# EAGLE design TPS54340 PS and Load Rev3 (EAGLE 9.3.0)
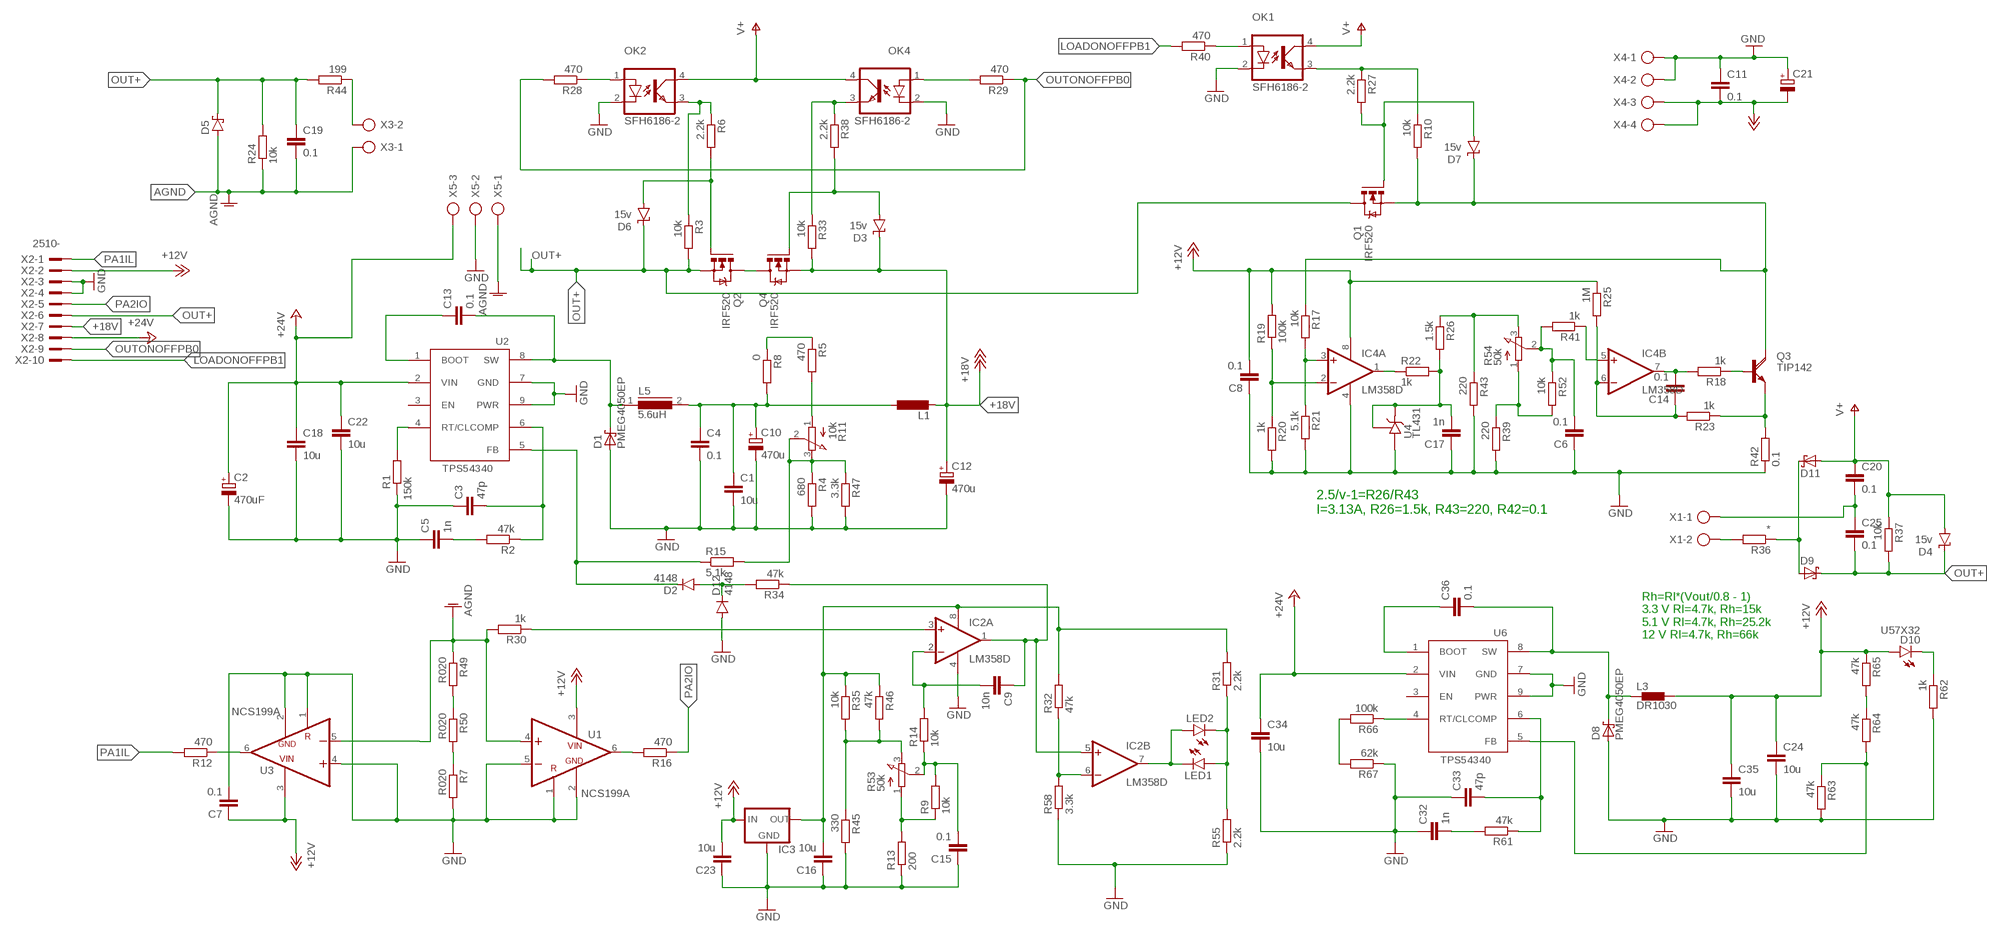
[diagram p0: schematic, sheet 1]

## Parts
C1  10u  C-EUC1210  [C1210]
C2  470uF  CPOL-EUE5-10.5  [E5-10,5]
C3  47p  C-EUC0603K  [C0603K]
C4  0.1  C-EUC1206  [C1206]
C5  1n  C-EUC0603K  [C0603K]
C6  0.1  C-EUC0603K  [C0603K]
C7  0.1  C-EUC0603K  [C0603K]
C8  0.1  C-EUC0603K  [C0603K]
C9  10n  C-EUC0603K  [C0603K]
C10  470u  CPOL-EUE5-10.5  [E5-10,5]
C11  0.1  C-EUC1206  [C1206]
C12  470u  CPOL-EUE5-10.5  [E5-10,5]
C13  0.1  C-EU102-043X133  [C102-043X133]
C14  0.1  C-EUC0603K  [C0603K]
C15  0.1  C-EUC0603K  [C0603K]
C16  10u  C-EUC0603K  [C0603K]
C17  1n  C-EUC0603K  [C0603K]
C18  10u  C-EUC1210  [C1210]
C19  0.1  C-EUC1206  [C1206]
C20  0.1  C-EUC1206  [C1206]
C21  CPOL-EUE2.5-6  [E2,5-6]
C22  10u  C-EUC1210  [C1210]
C23  10u  C-EUC0603K  [C0603K]
C24  10u  C-EUC1210  [C1210]
C25  0.1  C-EUC1206  [C1206]
C32  1n  C-EUC0603K  [C0603K]
C33  47p  C-EUC0603K  [C0603K]
C34  10u  C-EUC1210  [C1210]
C35  10u  C-EUC1206  [C1206]
C36  0.1  C-EU102-043X133  [C102-043X133]
D1  PMEG4050EP  [SOD128]
D2  4148  PMLL41SOD80C  [SOD80C]
D3  15v  SUPPRESSOR-SMBJ  [SMBJ]
D4  15v  SUPPRESSOR-SMBJ  [SMBJ]
D5  SCHOTTKY-DIODESMD  [SMB]
D6  15v  SUPPRESSOR-SMBJ  [SMBJ]
D7  15v  SUPPRESSOR-SMBJ  [SMBJ]
D8  PMEG4050EP  [SOD128]
D9  PMEG4050EP  [SOD128]
D10  U57X32  [U57X32]
D11  PMEG4050EP  [SOD128]
D12  4148  PMLL41SOD80C  [SOD80C]
IC2  LM358D  [SO08]
IC3  LM1117  [SOT223]
IC4  LM358D  [SO08]
L1  L-EU0207/5V  [0207/5V]
L3  DR1030  [DR1030]
L5  5.6uH  DR125  [DR125]
LED1  LEDB152  [Q62902-B152]
LED2  LEDB152  [Q62902-B152]
OK1  SFH6186-2  [SMD4-7]
OK2  SFH6186-2  [SMD4-7]
OK4  SFH6186-2  [SMD4-7]
Q1  IRF520  [TO220BV]
Q2  IRF520  [TO220BV]
Q3  TIP142  [SOT93]
Q4  IRF520  [TO220BV]
R1  150k  R-EU_R1206  [R1206]
R2  47k  R-EU_R0603  [R0603]
R3  10k  R-EU_R0603  [R0603]
R4  680  R-EU_R1206  [R1206]
R5  470  R-EU_R1206  [R1206]
R6  2.2k  R-EU_R0603  [R0603]
R7  R020  R-EU_R1206  [R1206]
R8  0  R-EU_R0603  [R0603]
R9  10k  R-EU_R0603  [R0603]
R10  10k  R-EU_R0603  [R0603]
R11  10k  3RP/1610N  [3RP/1610N]
R12  470  R-EU_R0603  [R0603]
R13  200  R-EU_R0603  [R0603]
R14  10k  R-EU_R1206  [R1206]
R15  5.1k  R-EU_R0603  [R0603]
R16  470  R-EU_R1206  [R1206]
R17  10k  R-EU_R0603  [R0603]
R18  1k  R-EU_R0603  [R0603]
R19  100k  R-EU_R1206  [R1206]
R20  1k  R-EU_R0603  [R0603]
R21  5.1k  R-EU_R0603  [R0603]
R22  1k  R-EU_R0603  [R0603]
R23  1k  R-EU_R0603  [R0603]
R24  10k  R-EU_R1206  [R1206]
R25  1M  R-EU_R1206  [R1206]
R26  1.5k  R-EU_R0603  [R0603]
R27  2.2k  R-EU_R0603  [R0603]
R28  470  R-EU_R0603  [R0603]
R29  470  R-EU_R0603  [R0603]
R30  1k  R-EU_R0603  [R0603]
R31  2.2k  R-EU_R0603  [R0603]
R32  47k  R-EU_R0603  [R0603]
R33  10k  R-EU_R0603  [R0603]
R34  47k  R-EU_R0603  [R0603]
R35  10k  R-EU_R0603  [R0603]
R36  *  R-EU_R1206  [R1206]
R37  10k  R-EU_R1206  [R1206]
R38  2.2k  R-EU_R0603  [R0603]
R39  220  R-EU_R0603  [R0603]
R40  470  R-EU_R0603  [R0603]
R41  1k  R-EU_R1206  [R1206]
R42  0.1  R-EU_0414/15  [0414/15]
R43  220  R-EU_R0603  [R0603]
R44  199  R-EU_R0603  [R0603]
R45  330  R-EU_R0603  [R0603]
R46  47k  R-EU_R0603  [R0603]
R47  3.3k  R-EU_R1206  [R1206]
R49  R020  R-EU_R1206  [R1206]
R50  R020  R-EU_R1206  [R1206]
R52  10k  R-EU_R0603  [R0603]
R53  50k  3RP/1610N  [3RP/1610N]
R54  50k  3RP/1610N  [3RP/1610N]
R55  2.2k  R-EU_R0603  [R0603]
R58  3.3k  R-EU_R0603  [R0603]
R61  47k  R-EU_R0603  [R0603]
R62  1k  R-EU_R0603  [R0603]
R63  47k  R-EU_R0603  [R0603]
R64  47k  R-EU_R0603  [R0603]
R65  47k  R-EU_R0603  [R0603]
R66  100k  R-EU_R0603  [R0603]
R67  62k  R-EU_R0603  [R0603]
U1  NCS199A  [SOT363]
U2  TPS54340  TPS54340SO8  [HSOP]
U3  NCS199A  [SOT363]
U4  TL431  [SOT23]
U6  TPS54340SO8  [HSOP]
X1  AK500/2  [AK500/2]
X2  2510-  [PAK100/2500-10]
X3  AK500/2  [AK500/2]
X4  AK500/4  [AK500/4]
X5  AK500/3  [AK500/3]

## Nets
+12V: C7.1 C8.2 C11.2 C21.- C23.2 C24.1 C35.1 D10.A IC3.3(IN) IC4.8(P:V+) L3.2 R19.2 R25.1 R65.1 U1.3(VCC) U3.3(VCC) X2.2 X4.3 X4.4
+18V: C12.+ D3.C L1.2 Q4.S R33.2 X2.7
+24V: C2.+ C18.1 C22.1 C34.1 U2.2(VIN) U6.2(VIN) X2.8 X5.3
AGND: C19.2 D5.A R24.1 R30.2 R49.1 U1.4(IN+) U3.5(IN-) X3.1 X5.1
GND: C1.2 C2.- C3.1 C4.2 C5.1 C6.1 C7.2 C8.1 C10.- C11.1 C12.- C15.1 C16.1 C17.1 C18.2 C21.+ C22.2 C23.1 C24.2 C32.1 C33.1 C34.2 C35.2 D1.2(A) D8.2(A) D12.A IC2.4(P:V-) IC3.1(GND) IC4.4(P:V-) OK1.2(C) OK2.2(C) OK4.2(C) R1.1 R4.2 R7.2 R13.1 R20.2 R21.2 R39.2 R42.1 R43.2 R45.2 R47.2 R55.1 R58.1 R62.2 R63.2 R67.1 U1.1(REF) U1.2(GND) U1.5(IN-) U2.7(GND) U2.9(PWR) U3.1(REF) U3.2(GND) U3.4(IN+) U4.3(A) U6.7(GND) U6.9(PWR) X2.3 X2.4 X4.1 X4.2 X5.2
LOADONOFFPB1: R40.2 X2.10
N$1: R1.2 U2.4(RT/CL)
N$2: C5.2 R2.2
N$3: C3.2 R2.1 U2.6(COMP)
N$4: R5.2 R11.1(A)
N$5: D6.A Q2.G R6.2
N$6: IC2.3(A:+IN) R30.1
N$7: R4.1 R11.2(S) R11.3(E) R15.2 R47.1
N$8: C16.2 IC2.8(P:V+) IC3.2(OUT) IC3.4(OUT) R31.2 R32.2 R35.1 R46.1
N$9: R16.2 U1.6(OUT)
N$10: OK2.3(EMIT) R3.1 R6.1
N$11: R36.2 X1.2
N$12: D3.A Q4.G R38.2
N$13: C13.1 U2.1(BOOT)
N$14: C13.2 D1.1(K) L5.1 U2.8(SW)
N$15: R12.1 U3.6(OUT)
N$16: C9.2 IC2.2(A:-IN) R14.2
N$17: D9.2(A) D11.1(K) R36.1
N$18: R44.1 X3.2
N$19: C15.2 R9.2 R14.1 R53.2(S)
N$20: D2.A D12.C R34.2
N$21: D2.C R15.1 U2.5(FB)
N$22: C20.2 C25.1 X1.1
N$23: Q2.D Q4.D
N$24: IC2.7(B:OUT) LED1.K(C) LED2.A
N$25: C1.1 C4.1 C10.+ L1.1 L5.2 R8.2
N$26: Q3.B R18.1
N$27: OK1.1(A) R40.1
N$28: C14.1 IC4.6(B:-IN) R23.2 R25.2
N$30: R26.1 R43.1 R54.3(E)
N$31: D7.C Q1.S Q3.C R10.2 R17.1
N$32: OK1.3(EMIT) R10.1 R27.1
N$34: LED1.A LED2.K(C) R31.1 R55.2
N$35: R35.2 R45.1 R46.2 R53.3(E)
N$36: IC4.5(B:+IN) R41.1
N$37: IC2.6(B:-IN) R32.1 R58.2
N$41: D7.A Q1.G R27.2
N$42: R39.1 R52.2 R54.1(A)
N$45: R9.1 R13.2 R53.1(A)
N$46: R49.2 R50.1
N$47: R63.1 R64.2 U6.5(FB)
N$48: C9.1 IC2.1(A:OUT) IC2.5(B:+IN) R34.1
N$49: R66.1 U6.4(RT/CL)
N$50: C33.2 R61.1 U6.6(COMP)
N$51: C36.1 U6.1(BOOT)
N$52: R7.1 R50.2
N$53: C36.2 D8.1(K) L3.1 U6.8(SW)
N$54: C32.2 R61.2
N$55: R64.1 R65.2
N$56: D10.K(C) R62.1
N$57: R66.2 R67.2
N$61: OK4.3(EMIT) R33.1 R38.1
N$62: OK4.1(A) R29.2
N$64: OK2.1(A) R28.1
N$65: C17.2 R22.2 R26.2 U4.1(C) U4.2(R)
N$66: R5.1 R8.1
N$106: Q3.E R23.1 R42.2
N$289: C14.2 IC4.7(B:OUT) R18.2
N$290: C6.2 R41.2 R52.1 R54.2(S)
N$291: IC4.1(A:OUT) R22.1
N$292: IC4.3(A:+IN) R17.2 R21.1
N$294: IC4.2(A:-IN) R19.1 R20.1
OUT+: C19.1 C25.2 D4.C D5.C D6.C D9.1(K) Q1.D Q2.S R3.2 R24.2 R37.2 R44.2 X2.6
OUTONOFFPB0: R28.2 R29.1 X2.9
PA1IL: R12.2 X2.1
PA2IO: R16.1 X2.5
V+: C20.1 D4.A D11.2(A) OK1.4(COL) OK2.4(COL) OK4.4(COL) R37.1
Unconnected: U2.3(EN) U6.3(EN)

## Notes on the sheet
- 2.5/v-1=R26/R43
  I=3.13A, R26=1.5k, R43=220, R42=0.1
- Rh=Rl*(Vout/0.8 - 1)
  3.3 V Rl=4.7k, Rh=15k
  5.1 V Rl=4.7k, Rh=25.2k
  12 V Rl=4.7k, Rh=66k

## Library data of the parts
C1 C3 C5-C9 C13-C18 C22-C24 C32-C34 C36 = rcl:C-EU: CAPACITOR, European symbol; SPICEPREFIX: C
C2 C10 C12 C21 = rcl:CPOL-EU: POLARIZED CAPACITOR, European symbol; SPICEPREFIX: C
C4 C11 C19 C20 C25 C35 = rcl:C-EU: CAPACITOR, European symbol
D1 D8 D9 D11 = NXP_60_26022015:PMEG4050E: 40 V, 5 A low VF MEGA Schottky barrier rectifier Planar Maximum Efficiency General Application (MEGA) Schottky barrier rectifier with an integrated guard ring for stress protection. AAL Eindhoven MK
D2 D12 = diode:PMLL41*: High-speed diodes Source: http://www.semiconductors.philips.com/acrobat_download/datasheets/PMLL4150_2.pdf
D3 D4 D6 D7 = diode:SUPPRESSOR-: Suppressor diode
D5 = diode:SCHOTTKY-DIODE: Schottky Diode
D10 = led:U57X32: LED rectangle, 5.7 x 3.2 mm
IC2 IC4 = linear:LM358: OP AMP also LM158; LM258; LM2904 Source: http://cache.national.com/ds/LM/LM158.pdf
IC3 = v-reg-2:LM1117
L1 = rcl:L-EU: INDUCTOR, European symbol; SPICEPREFIX: L
L3 = inductors:DR1030: DR1030 Series Low Profile Power Inductors Source: Data sheet <http://www.cooperbussmann.com/pdf/c73e479f-f867-4c64-ae26-9c1f23814163.pdf>; SPICEPREFIX: L
L5 = inductors:DR125: High Power Density, High Efficiency, Shielded Inductors Source: coiltronics_dr_series.pdf; SPICEPREFIX: L
LED1 LED2 = led:LED: LED OSRAM: - CHIPLED LG R971, LG N971, LY N971, LG Q971, LY Q971, LO R971, LY R971 LH N974, LH R974 LS Q976, LO Q976, LY Q976 LO Q996 - Hyper CHIPLED LW Q18S LB Q993, LB Q99A, LB R99A - SideLED LS A670, LO A670, LY A670, LG A670, LP A670 LB A673, LV A673, LT A673, LW A673 LH A674 LY A675 LS A676, LA A676, LO A676, LY A676, LW A676 LS A679, LY A679, LG A679 - Hyper Micro SIDELED® LS Y876, LA Y876, LO Y876, LY Y876 LT Y87S - SmartLED LW L88C, LW L88S LB L89C, LB L89S, LG L890 LS L89K, LO L89K, LY L89K LS L896, LA L896, LO L896, LY L896 - TOPLED LS T670, LO T670, LY T670, LG T670, LP T670 LSG T670, LSP T670, LSY T670, LOP T670, LYG T670 LG T671, LOG T671, LSG T671 LB T673, LV T673, LT T673, LW T673 LH T674 LS T676, LA T676, LO T676, LY T676, LB T676, LH T676, LSB T676, LW T676 LB T67C, LV T67C, LT T67C, LS T67K, LO T67K, LY T67K, LW E67C LS E67B, LA E67B, LO E67B, LY E67B, LB E67C, LV E67C, LT E67C LW T67C LS T679, LY T679, LG T679 LS T770, LO T770, LY T770, LG T770, LP T770 LB T773, LV T773, LT T773, LW T773 LH T774 LS E675, LA E675, LY E675, LS T675 LS T776, LA T776, LO T776, LY T776, LB T776 LHGB T686 LT T68C, LB T68C - Hyper Mini TOPLED® LB M676 - Mini TOPLED Santana® LG M470 LS M47K, LO M47K, LY M47K Source: http://www.osram.convergy.de LUXEON: - LUMILED® LXK2-PW12-R00, LXK2-PW12-S00, LXK2-PW14-U00, LXK2-PW14-V00 LXK2-PM12-R00, LXK2-PM12-S00, LXK2-PM14-U00 LXK2-PE12-Q00, LXK2-PE12-R00, LXK2-PE12-S00, LXK2-PE14-T00, LXK2-PE14-U00 LXK2-PB12-K00, LXK2-PB12-L00, LXK2-PB12-M00, LXK2-PB14-N00, LXK2-PB14-P00, LXK2-PB14-Q00 LXK2-PR12-L00, LXK2-PR12-M00, LXK2-PR14-Q00, LXK2-PR14-R00 LXK2-PD12-Q00, LXK2-PD12-R00, LXK2-PD12-S00 LXK2-PH12-R00, LXK2-PH12-S00 LXK2-PL12-P00, LXK2-PL12-Q00, LXK2-PL12-R00 Source: www.luxeon.com KINGBRIGHT: KA-3528ASYC Source: www.kingbright.com
OK1 OK2 OK4 = optocoupler:SFH618?*: Optocoupler, Phototransistor Output, Low Input Current Source: Data sheet <http://www.vishay.com/docs/83673/sfh618.pdf>; MF: VISHAY/TELEFUNKEN; MPN: SFH6186-2; OC_FARNELL: 1469583; OC_NEWARK: 58K2210
Q1 Q2 Q4 = transistor-power:IRF520: HEXFET Power MOSFET
Q3 = transistor-power:TIP142: NPN DARLINGTON TRANSISTOR
R1 R4 R5 R7 R14 R16 R19 R24 R25 R36 R37 R41 R47 R49 R50 = rcl:R-EU_: RESISTOR, European symbol
R2 R3 R6 R8-R10 R12 R13 R15 R17 R18 R20-R23 R26-R35 R38-R40 R42-R46 R52 R55 R58 R61-R67 = rcl:R-EU_: RESISTOR, European symbol; SPICEPREFIX: R
R11 R53 R54 = pot:3RP/1610N: 16mm Potentiometer one level Source: http://www.alphapotentiometers.net/html/16mm_pot_2.html
U1 U3 = ProjectLibrary:NCS199A: NCS199A Current-Shunt Monitor, Voltage Output, Bi-Directional Zero-Drift The LNA is housed in a 6-pin SOT363 plastic SMD package.
U2 U6 = ProjectLibrary:TPS54340: TPS54340 42 V Input, 3.5 A, Step Down DC-DC Converter with Eco-mode™
U4 = 1my:TL431
X1 X3 = con-ptr500:AK500/2: CONNECTOR; OC_FARNELL: unknown; OC_NEWARK: unknown
X2 = con-3m:2510-: 3M (TM) Pak 100 4-Wall Header Source: 3M; MF: 3M; MPN: 2510-6002UB; OC_FARNELL: 9838244; OC_NEWARK: 46F4725
X4 = con-ptr500:AK500/4: CONNECTOR; OC_FARNELL: unknown; OC_NEWARK: unknown
X5 = con-ptr500:AK500/3: CONNECTOR; OC_FARNELL: unknown; OC_NEWARK: unknown

## Board
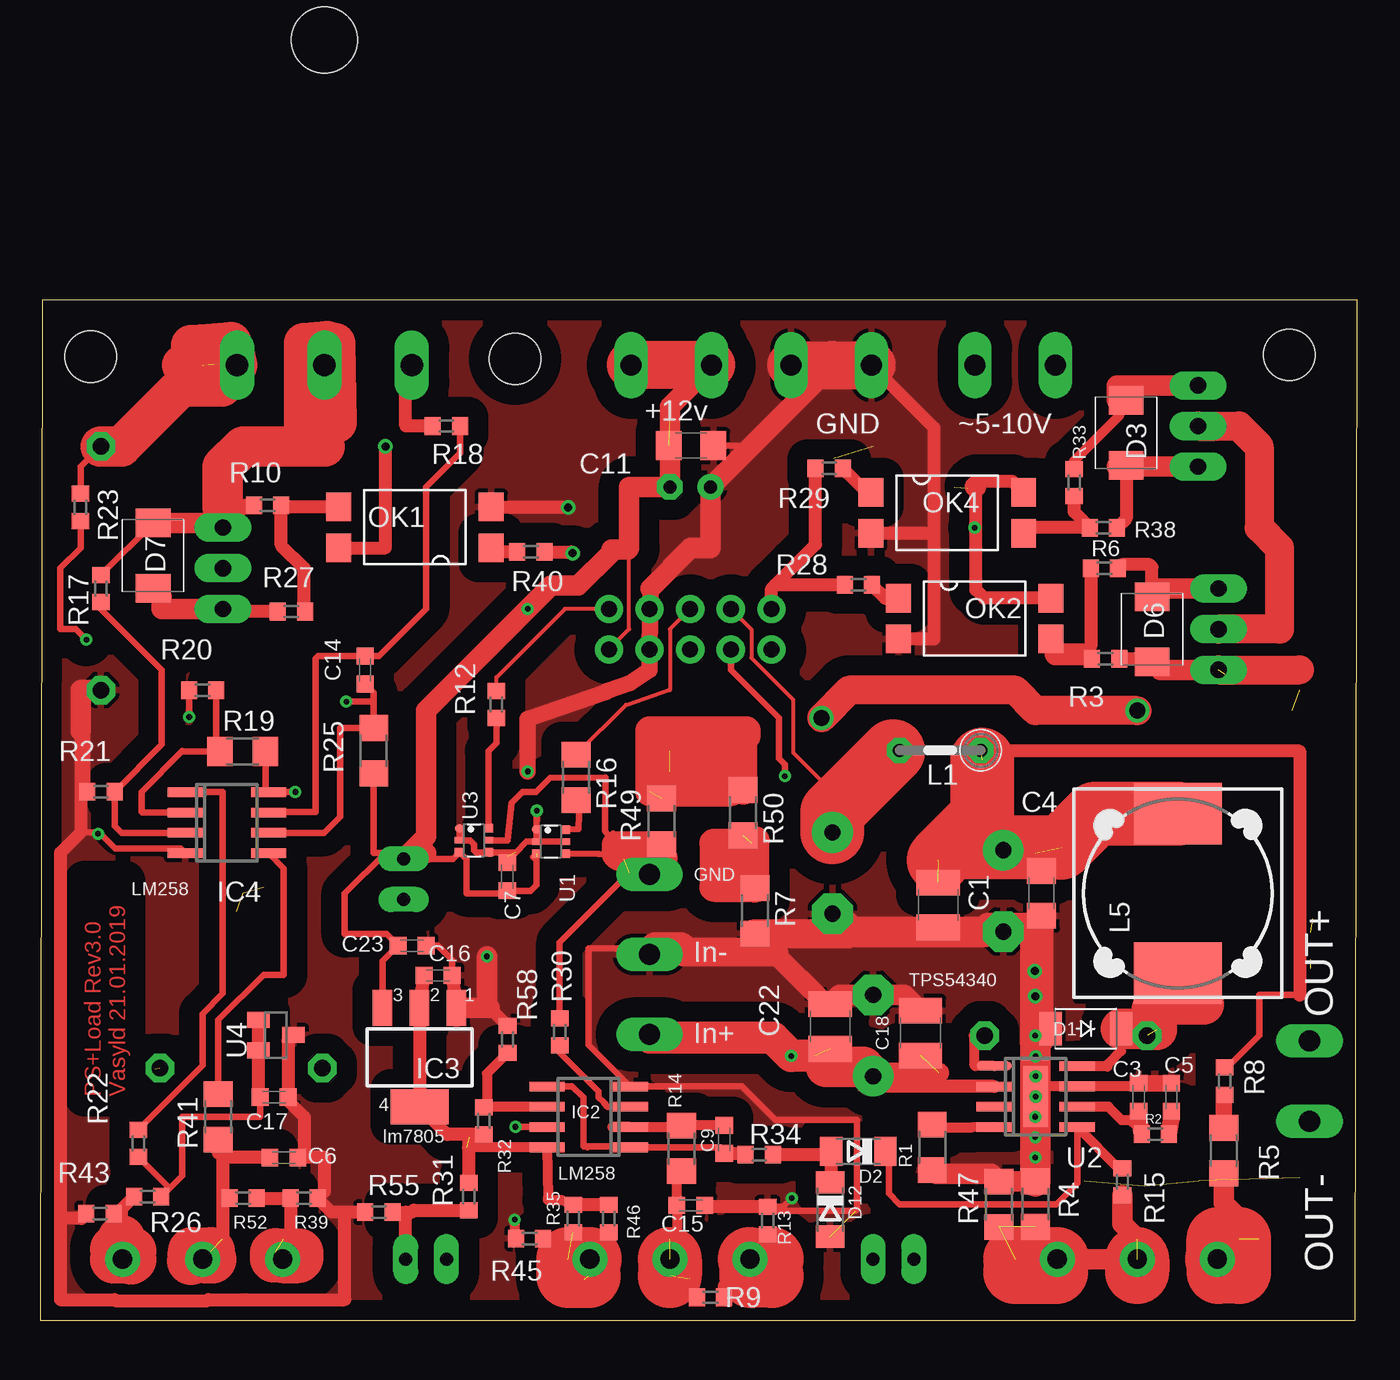
[diagram p1: board, top side]
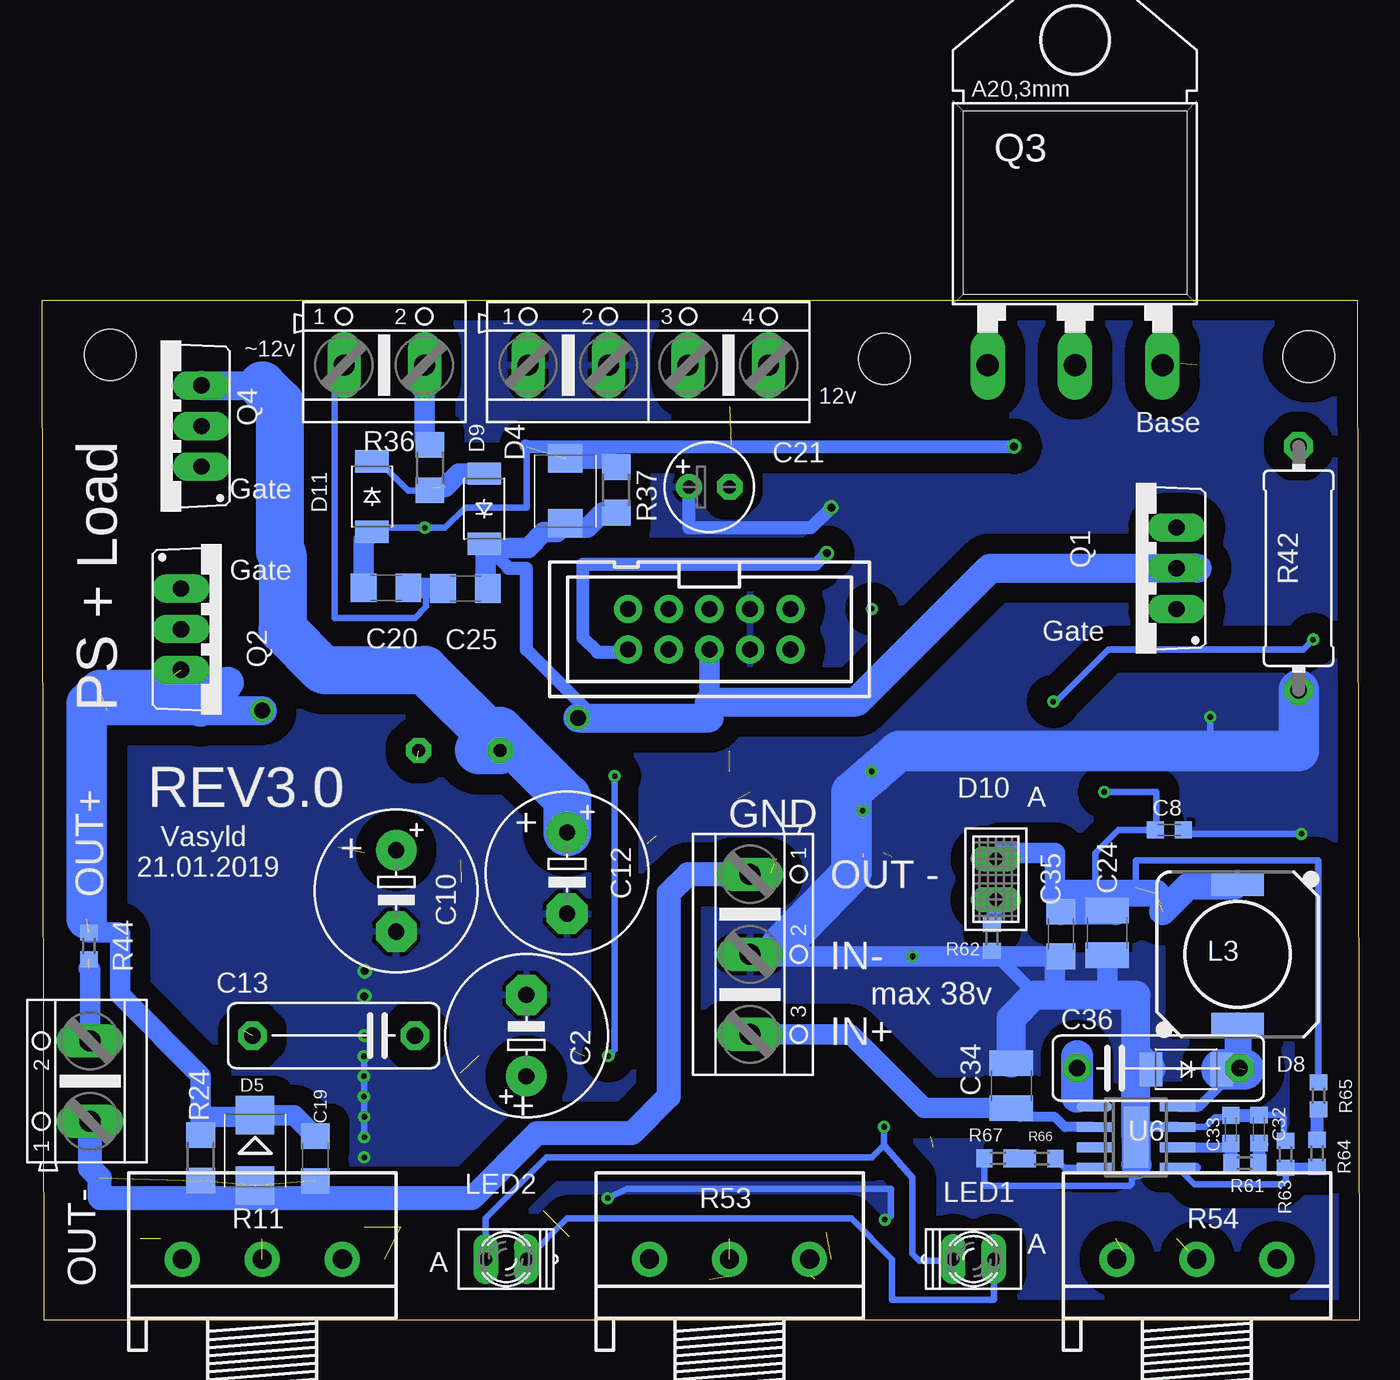
[diagram p2: board, bottom side, seen from below]

Size 82.35 x 63.76 mm. Coordinates in mm from the lower left corner, seen from the top.
Outline: 0,0 82.22,0 82.35,63.76 0.13,63.76 0,0
Copper layers (1*16): Top 0.035mm / dielectric 1.5mm / Bottom 0.035mm
Design rules "Charger for battery (TPS54340) power *": minimum track width 10mil, minimum drill 0.35mm, track to track 22mil, track to pad 10mil, pad to pad 20mil, via to via 20mil, smd to smd 6mil, copper to edge 30mil, drill to drill 6mil, minimum pad ring 15mil, minimum via ring 8mil, stop-mask expansion 4mil, vias tented up to drill 0mil, thermal gap 10mil
Holes 3.2 mm at 3.16,60.21 78.09,60.33 29.69,60.08

### Footprints (pad centres in the part's own frame; a part is rotated, then mirrored left to right if it is on the bottom)
C1210 = smd 1.6 x 2.7: 1 -1.4,0; 2 1.4,0
E5-10,5 = drill 1.016 pad 2.54: + -2.54,0 | drill 1.016 pad 2.54 octagon: - 2.54,0
C0603K = smd 1.05 x 1.08: 1 -0.875,0; 2 0.875,0
C1206 = smd 1.6 x 1.8: 1 -1.4,0; 2 1.4,0
C102-043X133 = drill 1.016 octagon: 1 -5.08,0; 2 5.08,0
E2,5-6 = drill 0.813 pad 1.6: + -1.27,0 | drill 0.813 pad 1.6 octagon: - 1.27,0
SOD128 = smd 1.4 x 2.1: 1 -2.2,0; 2 2.2,0
SOD80C = smd 1.4 x 1.8: A 1.7,0; C -1.7,0
SMBJ = smd 1.78 x 2.16: A 2.04,0; C -2.03,0
SMB = smd 2.4 x 2.4: A 2.2,0; C -2.2,0
U57X32 = drill 0.813 long: A -1.27,0; K 1.27,0
SO08 = smd 0.6 x 2.2: 1 -1.905,-2.6; 2 -0.635,-2.6; 3 0.635,-2.6; 4 1.905,-2.6; 5 1.905,2.6; 6 0.635,2.6; 7 -0.635,2.6; 8 -1.905,2.6
SOT223 = smd 1.219 x 2.235: 1 -2.311,-3.099; 2 0,-3.099; 3 2.311,-3.099 | smd 3.6 x 2.2: 4 0,3.099
0207/5V = drill 0.813 octagon: 1 -2.54,0; 2 2.54,0
DR1030 = smd 3.3 x 1.6: 1 0,4.45; 2 0,-4.45
DR125 = smd 3.85 x 5.5: 1 -4.975,0; 2 4.975,0
Q62902-B152 = drill 0.813 long: A 1.27,0; K -1.27,0
SMD4-7 = smd 1.78 x 1.55: 1 -1.27,-4.77; 2 1.27,-4.77; 3 1.27,4.77; 4 -1.27,4.77
TO220BV = drill 1.016 long: D 0,-2.54; G -2.54,-2.54; S 2.54,-2.54
SOT93 = drill 1.397 long: B -5.461,-10.16; C 0,-10.16; E 5.461,-10.16 | hole 4.115: 0,10.16
R1206 = smd 1.6 x 1.803: 1 -1.422,0; 2 1.422,0
R0603 = smd 1 x 1.1: 1 -0.85,0; 2 0.85,0
3RP/1610N = drill 1.2 pad 2.184: 1 -5,0; 2 0,0; 3 5,0
0414/15 = drill 1.016 octagon: 1 -7.62,0; 2 7.62,0
SOT363 = smd 0.524 x 0.6: 1 -0.75,-0.9; 3 0.75,-0.9; 4 0.75,0.9; 6 -0.75,0.9 | smd 0.4 x 0.6: 2 0,-0.9; 5 0,0.9
HSOP = smd 0.6 x 2.2: 1 -1.905,-2.6; 2 -0.635,-2.6; 3 0.635,-2.6; 4 1.905,-2.6; 5 1.905,2.6; 6 0.635,2.6; 7 -0.635,2.6; 8 -1.905,2.6 | smd 3.81 x 1.524: 9 0,0
SOT23 = smd 1 x 1.4: 1 -0.95,-1.1; 2 0.95,-1.1; 3 0,1.1
AK500/2 = drill 1.321 long: 1 -2.515,0; 2 2.515,0
PAK100/2500-10 = drill 1 pad 1.422: 1 -5.08,-1.27; 2 -5.08,1.27; 3 -2.54,-1.27; 4 -2.54,1.27; 5 0,-1.27; 6 0,1.27; 7 2.54,-1.27; 8 2.54,1.27; 9 5.08,-1.27; 10 5.08,1.27
AK500/4 = drill 1.321 long: 1 -7.518,0; 2 -2.489,0; 3 2.489,0; 4 7.518,0
AK500/3 = drill 1.321 long: 1 -5.004,0; 2 0,0; 3 5.004,0

### Placement (x,y rotation side)
C1  56.13,25.95 270 top
C2  52.07,17.78 90 bottom
C3  68.67,13.93 270 top
C4  62.6,26.67 270 top
C5  70.71,13.93 270 top
C6  15.24,10.16 180 top
C7  29.21,27.71 90 top
C8  11.89,30.63 180 bottom
C9  42.77,11.29 90 top
C10  60.21,26.82 270 bottom
C11  40.69,54.66 180 top
C12  49.53,27.94 270 bottom
C13  64.12,17.78 180 bottom
C14  20.32,40.64 90 top
C15  40.68,7.18 180 top
C16  24.88,21.54 180 top
C17  14.63,13.93 180 top
C18  55.03,17.93 90 top
C19  65.27,10.1 270 bottom
C20  60.85,45.77 0 bottom
C21  40.64,52.07 0 bottom
C22  49.39,18.35 90 top
C23  23.25,23.41 180 top
C24  15.77,24.21 270 bottom
C25  55.88,45.72 0 bottom
C32  6.29,11.94 270 bottom
C33  8.04,11.91 270 bottom
C34  21.77,14.66 90 bottom
C35  18.67,24.13 270 bottom
C36  12.57,15.75 0 bottom
D1  65.37,18.21 180 top
D2  51.14,10.54 180 top
D3  67.89,55.46 270 top
D4  49.63,51.82 90 bottom
D5  69.04,10.6 270 bottom
D6  69.51,43.18 90 top
D7  7.07,47.79 270 top
D8  10.83,15.67 180 bottom
D9  54.71,50.71 90 bottom
D10  22.73,27.56 270 bottom
D11  61.72,51.47 270 bottom
D12  49.39,6.91 270 top
IC2  34.29,12.7 90 top
IC3  23.72,16.42 180 top
IC4  11.68,31.09 270 top
L1  56.26,35.61 180 top
L3  7.62,22.86 180 bottom
L5  71.12,26.67 90 top
LED1  24.13,3.81 0 bottom
LED2  53.34,3.81 180 bottom
OK1  23.43,49.56 90 top
OK2  58.42,43.85 270 top
OK4  56.71,50.46 270 top
Q1  13.97,46.99 90 bottom
Q2  71.12,43.18 270 bottom
Q3  17.78,69.85 0 bottom
Q4  74.93,55.88 90 bottom
R1  55.77,10.81 90 top
R2  69.71,11.63 0 top
R3  66.6,41.33 0 top
R4  62.2,7.25 90 top
R5  73.99,10.59 270 top
R6  66.52,46.98 0 top
R7  44.68,25.58 270 top
R8  74.04,14.94 90 top
R9  41.91,1.42 180 top
R10  14.24,50.91 180 top
R11  68.58,3.81 0 bottom
R12  28.52,38.48 90 top
R13  45.48,6.22 270 top
R14  40.09,10.73 90 top
R15  67.65,8.64 270 top
R16  33.5,33.92 270 top
R17  3.81,45.72 270 top
R18  25.4,55.88 0 top
R19  12.67,35.55 0 top
R20  10.16,39.37 180 top
R21  3.81,33.02 180 top
R22  6.15,11.05 270 top
R23  2.54,50.8 270 top
R24  72.43,10.13 90 bottom
R25  20.87,35.59 90 top
R26  6.73,7.72 0 top
R27  15.71,44.28 180 top
R28  51.16,45.95 180 top
R29  49.33,53.23 0 top
R30  32.49,18.02 90 top
R31  26.81,7.72 90 top
R32  27.75,12.45 270 top
R33  64.63,52.35 90 top
R34  44.96,10.35 0 top
R35  33.32,6.35 270 top
R36  58.1,53.28 90 bottom
R37  46.46,51.89 270 bottom
R38  66.47,49.53 0 top
R39  16.51,7.62 0 top
R40  30.68,48.02 0 top
R41  11.14,12.7 270 top
R42  3.81,46.99 90 bottom
R43  3.75,6.67 180 top
R44  79.41,23.38 90 bottom
R45  30.61,5.11 180 top
R46  35.56,6.35 270 top
R47  59.93,7.24 90 top
R49  38.84,31.18 90 top
R50  43.94,31.71 270 top
R52  12.7,7.62 0 top
R53  39.37,3.81 0 bottom
R54  10.16,3.81 0 bottom
R55  21.18,6.74 0 top
R58  29.22,17.54 270 top
R61  7.18,9.8 0 bottom
R62  22.97,23.91 270 bottom
R63  4.62,10.36 90 bottom
R64  2.67,10.41 270 bottom
R65  2.57,14.01 270 bottom
R66  19.86,10.1 180 bottom
R67  22.61,10.11 0 bottom
U1  31.94,29.91 270 top
U2  62.23,13.97 270 top
U3  27.13,29.98 270 top
U4  14.74,17.82 270 top
U6  13.97,11.43 270 bottom
X1  60.96,59.69 0 bottom
X2  40.64,43.18 180 bottom
X3  79.35,14.94 90 bottom
X4  44.45,59.69 0 bottom
X5  38.1,22.86 270 bottom

### Tracks (layer width: path | path; a pad name or v marks a point on that pad's centre or on a via)
+12V  (via drill 0.35)  (4 unrouted)
  Top 0.254: X2.2 36.83,43.18 36.83,48.26
  Top 0.406: U3.3 26.18,29.19 | 31.04,28.94 30.82,28.94 31.03,28.74 31.03,27.19 30.67,26.84 C7.1 29.04,26.67 26.67,26.67 26.67,28.79 U3.3 | U3.3 25.82,28.83 23.75,28.83 | IC4.8 14.63,32.99 14.64,33.01 v15.95,33.01 | IC4.8 13.8,32.99 | R19.2 14.1,33.18 IC4.8 | R25.1 20.87,29.21 21.59,29.21 | 21.59,29.21 22.35,29.21 D10.A | IC3.3 21.41,22.44 C23.2 21.66,24.13 19.05,24.13 19.05,26.67 21.59,29.21
  Top 0.813: 24.13,38.1 24.13,29.21 23.75,28.83 D10.A
  Top 1.27: X4.3 39.37,57.1 C21.- 36.83,52.07 36.83,48.26 36.74,48.17 35.71,48.17 35.71,47.97 33.64,45.9 31.93,45.9 v30.48,44.45 24.13,38.1 24.13,30.23 D10.A 23.11,29.21 24.13,29.21
  Top 3: X4.3 X4.4
  Bottom 0.406: R65.1 2.56,28.71 13.97,28.71 13.97,27.05 | 16.51,26.67 16.51,29.21 15.09,30.63 C8.2 12.7,30.7 12.7,33.02 15.94,33.02 v15.95,33.01
  Bottom 1.27: 18.67,26.8 18.67,26.67 C35.1 | C24.1 15.32,25.61 15.24,25.53 | 19.05,26.67 19.05,29.21 22.35,29.21 D10.A
  Bottom 1.7: 15.24,25.53 C35.1 | 12.7,26.67 16.51,26.67 18.67,26.67 19.05,26.67 | L3.2 7.82,27.11 10.72,27.11 12.3,25.53
+18V
  Top 0.254: X2.7 44.46,43.17 44.46,41.39 47.07,38.78 47.07,35.48 49.53,33.02 C12.+
  Top 0.61: R33.2 64.63,53.7 67.46,56.53 67.46,57.06 D3.C 67.31,57.49
  Top 1.27: Q4.S 67.31,58.42 67.31,57.49
  Top 4: C12.+ 49.53,31.75 53.34,35.56
  Bottom 1.8: Q4.S 68.58,58.42
  Bottom 3: 68.58,58.42 67.49,57.33 67.49,48.06 67.31,47.88 67.31,43.18 64.77,40.64 58.42,40.64 53.72,35.94 L1.2 | L1.2 53.72,36.83 49.53,32.64 C12.+ | L1.2 55.04,35.61
+24V  (via drill 0.35)  (2 unrouted)
  Top 0.406: X2.8 43.18,40.64 46.18,37.64 46.18,35.12 46.56,34.73 v46.56,34
  Top 0.813: U2.2 52.7,14.61 C2.+
  Top 1.27: C2.+ 52.29,15.46 56.19,15.46
  Top 2: 49.12,15.84 48.45,16.51 v46.95,16.51 45.82,17.64 38.1,17.64 X5.3
  Top 2.54: C2.+ 51.47,15.84 49.12,15.84
  Bottom 0.406: v46.56,34 46.56,16.9 v46.95,16.51
  Bottom 0.61: C34.1 21.21,12.7 19.05,12.7 18.41,12.06 U6.2
  Bottom 1.27: C34.1 27.23,13.26 31.83,17.86 X5.3
AGND  (4 unrouted)
  Top 0.406: R30.2 32.49,23.6 36.83,27.94 38.02,27.94 X5.1 | 35.81,30.42 35.94,29.76 | U1.4 34.91,29.12 35.92,29.1 | U3.5 29.21,29.97 29.46,32.32 30.16,33.02 31.01,33.02 31.88,33.9 35.33,33.92 35.31,30.57 35.92,29.73
  Top 1.6: R49.1 35.94,29.76 35.92,29.73 35.92,29.1 36.13,28.88 36.54,28.88 | 39.08,28.88 36.54,28.88 | 36.54,28.88 36.47,28.82
  Bottom 1.5: X5.1 41.99,27.86 43.18,26.67 43.18,13.97 45.48,11.67 51.43,11.67 55.48,7.62 78.74,7.62 78.74,8.89 79.35,9.5 X3.1
GND  (via drill 0.35, 0.5, 0.5 pad 0.7)  (2 unrouted)
  Top 0.406: U1.5 U1.2 | U1.2 U1.1 v31.05,31.84 | 28.14,29.12 U3.4 | U3.4 27.27,29.23 27.14,29.36 27.14,29.73 26.89,29.98 U3.2 U3.1 | 62.2,16.51 v62.23,16.48 | U2.9 62.23,12.72 v62.2,12.7 | 62.6,17.48 62.29,17.78 v62.2,17.78 | 40.01,23.24 34.29,23.24 34.29,17.2 IC2.4 43.89,14.61 45.97,12.52 51.05,12.52 51.05,6.88 50.99,6.82 45.73,6.82 R13.1 46.41,7.07 46.41,7.04 v46.99,7.62 | U1.2 30.43,29.91 29.75,29.23 U3.4 | C7.2 29.21,28.98 29.18,29 | 2.96,37.25 R21.2 2.54,32.6 2.54,30.48 3.71,30.48 | IC4.4 8.78,29.49 4.71,29.49 3.71,30.48 | 3.71,30.48 v3.63,30.39 | R20.2 9.31,37.84 9.46,37.69 v9.32,37.69 | C23.1 24.85,23.41 25.75,22.51 C16.1 | C11.1 44.4,54.66 44.45,54.61
  Top 0.61: C3.1 68.22,14.61 U2.7 62.87,14.61 U2.9 | v29.67,6.27 29.67,5.19 R45.2
  Top 0.813: C5.1 70.65,14.87 68.85,14.87 | U4.3 15.51,17.48 C17.1 15.51,13.71 16.51,12.7 16.51,10.55 C6.1 17.78,10.16 17.78,8.04 R39.2 18.24,6.74 19.05,6.74 | OK4.2 55.88,49.19 | 55.88,49.19 55.88,42.58 OK2.2 | X4.1 55.88,55.78 55.88,49.19 | OK1.2 32.99,50.83 v33.02,50.8 | 19.05,6.74 R55.1 20.21,6.87 | R13.1 41.66,7.07 C15.1 | 28.09,19.52 R58.1 | C16.1 IC3.1 | 2.54,38.1 2.54,36.83 2.54,30.48 1.27,29.21 1.27,6.35 | 1.27,6.35 1.27,1.27 4.65,1.27 4.71,1.22 10.47,1.22 10.52,1.27 19.05,1.27 19.05,6.74 | R43.2 2.58,6.35 1.27,6.35
  Top 1.016: C3.1 C5.1 70.73,14.81 | 38.15,45.72 X2.4 38.1,40.64 36.88,39.83 35.43,39.33 35.4,39.27 30.48,37.59 v30.48,34.29
  Top 1.27: R1.1 56.01,9.14 59.45,9.14 R47.2 R4.2 | 44.54,24.02 R7.2 45.85,22.99 49.08,19.75 C22.2 49.96,20.32 C2.- 54.04,20.32 C18.2 | 49.53,59.69 44.45,54.61 C21.+ 41.91,48.26 40.64,48.26 40.64,48.21 38.15,45.72 | IC3.1 27.94,19.52 | 27.94,19.52 28.09,19.52 | 27.94,19.52 v27.94,22.73 | 2.54,36.83 2.54,39.37 R42.1
  Top 1.5: C4.2 62.6,17.48
  Top 1.8: 45.85,22.99 40.26,22.99 40.01,23.24 38.88,23.24 | R7.2 50.57,24.16 50.67,24.26
  Top 1.9: R4.2 v62.2,10.16 v62.2,11.43 v62.2,12.7 62.2,16.51 v62.2,17.78 62.2,24.38 62.06,24.52 59.32,24.52 59.05,24.26 50.67,24.26 C12.-
  Top 2: 40.01,23.24 38.48,23.24 X5.2
  Top 3: X4.2 49.53,59.69 X4.1
  Bottom 0.406: v62.23,16.48 U2.9 62.23,11.46 v62.2,11.43 | v62.2,10.16 62.23,10.16 | R67.1 23.46,8.47 23.37,8.38 14.35,8.38 14.22,8.51 14.22,9.45 13.97,9.7 | U6.7 9.63,12.06 9.03,12.66 8.16,12.66 C33.1 | C32.1 4.9,12.81 4.72,12.64 4.72,11.31 R63.2 | v46.99,7.62 45.78,8.22 29.3,8.22 29.3,6.49 v29.67,6.27 | v31.05,31.84 31.75,33.02 | v3.63,30.39 10.77,30.39 C8.1 | v9.32,37.69 9.32,35.6 9.28,35.56
  Bottom 0.61: 8.28,12.55 C33.1 | U6.7 13.34,12.06 U6.9
  Bottom 0.813: v33.02,50.8 34.29,49.53 41.91,49.53 C21.+ | R62.2 20.23,20.32 | C33.1 6.31,12.79 C32.1
  Bottom 1.016: C32.1 6.31,12.84 | v30.48,34.29 30.48,34.11 | 36.15,23.43 36.83,22.73
  Bottom 1.27: D8.2 13.35,15.67 13.83,16.15 13.97,16.02 13.97,20.32 | 19.05,20.32 19.05,22.35 C35.2 v27.94,22.73 36.83,22.73 37.97,22.73 X5.2 | C24.2 15.77,20.85 15.24,20.32
  Bottom 1.8: 13.97,16.02 U6.9 13.97,9.77 | D8.2 13.97,16.61 13.97,20.32 15.24,20.32 19.05,20.32 20.23,20.32 20.32,20.32 21.77,18.87 C34.2 | 13.91,9.71 13.97,9.77 | 13.99,9.73 13.97,9.7 13.97,9.77
  Bottom 2.54: 36.15,23.43 31.75,27.94 31.75,33.02 30.48,34.11 28.79,35.56 9.28,35.56 3.81,35.56 R42.1
  other vias: 62.2,20.24 62.18,21.82 62.23,15.24 62.23,13.97
  pour Bottom (isolate 1.27, no thermals): 25.4,22.86 11.94,22.86 11.94,17.28 1.27,17.28 1.27,7.62 25.4,7.62
  pour Bottom (isolate 1.27, rank 3): 82.55,0 82.55,63.5 0,63.5 0,0
  pour Top (isolate 1.27, rank 2): 0,63.5 82.55,63.5 82.55,0 0,0
LOADONOFFPB1  (via drill 0.5)
  Top 0.813: R40.2 33.21,48.02 v33.3,47.93
  Bottom 0.813: v33.3,47.93 34,47.23 48.55,47.23 48.55,42.66 47.64,41.74 45.88,41.74 X2.10
N$1
  Top 0.61: U2.4 58.28,12.05 55.95,12.05 R1.2
N$2
  Top 1.016: C5.2 70.7,12.62 R2.2
N$3
  Top 0.61: U2.6 66.78,13.34 67.61,12.5 68.45,12.5 C3.2
  Top 1.016: R2.1 68.67,12.64 68.52,12.52 68.45,12.5
N$4  (1 unrouted)
  Top 1.27: R5.2 73.99,7.29 76.2,5.08
  Top 4: R11.1 73.66,3.89 73.66,5.08 74.93,5.08 74.93,3.02 73.66,3.02
N$5
  Top 0.813: D6.A 69.51,47.07 69.36,47.22 67.61,47.22 R6.2
  Top 1.27: D6.A 70.01,45.72 Q2.G
N$6
  Top 0.406: IC2.3 35.48,13.34 35.26,13.56 35.26,13.6 34.92,13.93 34.92,14.31 32.49,16.75 R30.1
N$7  (3 unrouted)
  Top 1.27: R15.2 67.65,6.01 68.58,5.08 | 63.5,3.02 64.29,3.81 R11.2
  Top 4: R11.3 60.96,3.81 60.96,3.02 63.5,3.02 | R11.2 68.58,3.02
N$8  (1 unrouted)
  Top 0.61: 26.67,10.79 IC2.8 31.75,7.62 31.74,7.51 32.61,7.51 R35.1
  Top 0.813: 35.5,7.26 R46.1 R35.1 | IC3.4 24.46,12.59 | R32.2 26.67,11.6 | 26.67,11.6 25.45,11.6 IC3.4 | R31.2 26.81,11.46 26.67,11.6 | IC3.4 IC3.2 C16.2
N$9
  Top 0.406: U1.6 33.66,30.71 33.69,31.61 33.69,32.36 R16.2
N$10
  Top 0.813: R3.1 63.37,41.33 63.22,41.48 63.22,41.88 63.89,41.88 | 63.89,41.88 OK2.3 | R6.1 65.67,42.11 65.44,41.88 63.89,41.88
N$11
  Bottom 1.27: X1.2 58.45,55.04 R36.2
N$12
  Top 0.813: D3.A 67.89,50.1 R38.2
  Top 1.27: Q4.G 67.31,53.34 67.39,53.42 D3.A
N$13
  Top 0.61: U2.1 58.45,15.88 58.41,15.91 58.41,17.73 58.37,17.77 58.38,17.78 C13.1
N$14  (1 unrouted)
  Top 0.61: U2.8 66.7,15.88 66.74,15.84 66.74,15.99 67.57,16.82 D1.1
  Top 2.54: D1.1 69.75,18.21 69.81,18.15 69.81,19.13 69.48,19.46 69.75,19.72 | 69.75,19.72 72.75,19.72 | L5.1 71.12,21.09 69.75,19.72
N$15
  Top 0.406: U3.6 28.03,35.56 28.52,36.06 R12.1
N$16
  Top 0.61: 42.58,11.98 C9.2 40.8,12.16 40.72,12.08 40.58,12.08 | 35.75,12.06 IC2.2 40.56,12.06 40.58,12.08 | R14.2 40.02,12.08 40.58,12.08
N$17  (1 unrouted)
  Bottom 0.406: R36.1 59.47,51.85 61.29,53.67 D11.1
  Bottom 1.27: 58.15,51.8 R36.1 57.96,51.99 | D9.2 56.31,52.91 57.15,52.07
N$18  (1 unrouted)
  Bottom 1.27: X3.2 79.35,21.92 79.43,22
N$19  (2 unrouted)
  Top 0.61: R14.1 39.8,9.02 C15.2 39.8,5.51 39.37,5.08
  Top 0.813: R9.2 40.64,1.84 40.64,2.54
  Top 4: R53.2 39.37,2.76
N$20
  Top 0.813: R34.2 49.25,10.35 D2.A 49.44,8.66 D12.C
N$21
  Top 0.406: U2.5 64.83,8.53 63.54,7.24 53.72,7.24 53.05,7.91 53.05,10.34 D2.C
  Top 0.61: U2.5 67.41,9.49 R15.1
N$22
  Bottom 0.406: 64.15,59.02 X1.1 64.05,59.12 64.05,43.88 59.04,43.88 58.33,44.59 58.33,45.66 58.22,45.77
  Bottom 1.27: C25.1 57.33,45.77 58.22,45.77 C20.2
N$23
  Top 1.8: Q4.D 74.93,55.88 76.2,54.61 76.2,49.53 77.47,48.26 77.47,43.18 Q2.D
N$24  (via drill 0.35)
  Top 0.406: IC2.7 29.73,12.06 v29.72,12.08
  Bottom 0.406: 29.72,10.92 30.48,10.16 50.8,10.16 54.61,6.35 LED2.A | 29.72,10.92 v29.72,12.08 | 29.72,10.92 27.94,8.89 27.94,4.13 27.52,3.71 25.5,3.71 LED1.K
N$25  (3 unrouted)
  Top 0.406: 78.74,20.32 76.2,20.32 76.2,17.78 74.2,15.79
  Top 0.813: R8.2 74.2,15.79 | 78.74,20.32 78.74,35.56 58.8,35.56 L1.1
  Top 1.27: C4.1 62.23,28.44 62.23,29.21 62.08,29.36 C10.+
  Top 4: L5.2 65.94,31.64 63.83,29.54 56.95,29.54 | 56.95,29.54 56.16,28.75 | 56.95,29.54 58.9,31.5 58.9,35.01
N$26
  Top 0.813: R18.1 22.86,55.88 22.86,59.69 Q3.B
N$27
  Top 0.813: R40.1 28.47,48.02 OK1.1
N$28  (via drill 0.35)
  Top 0.406: 14.26,30.48 IC4.6 17.75,30.45 18.75,31.45 18.75,37.01 R25.2 20.87,38.52 | C14.1 20.87,39.22 20.87,38.52 | R23.2 2.54,48.26 1.27,46.99 1.27,43.18 2.25,43.18 v2.9,42.53 | v19.14,38.66 20.73,38.66 20.87,38.52
  Bottom 0.406: v2.9,42.53 3.52,41.91 15.71,41.91 18.96,38.66 v19.14,38.66
N$30
  Top 0.813: R43.1 5.08,6.18 | 5.08,6.18 5.08,4.88 | R26.1 5.08,6.92 5.08,6.18
  Top 3: R54.3 4.65,3.81 4.64,3.8 5.61,3.8 5.69,3.72 5.77,3.8 5.77,4.3 4.76,4.3 4.64,4.43 5.08,4.88 5.08,5.08
N$31
  Top 0.406: R17.1 D7.C
  Top 0.813: R10.2 12.81,50.91 Q1.S
  Top 1.27: D7.C 11.14,49.82 Q1.S 11.43,50.8
  Top 2.54: 16.51,55.88 Q3.C 17.78,59.18 18.45,61.06 18.54,56.11 16.51,55.88 | 16.51,55.88 16.52,61.06 17.93,61.19 | 11.43,50.8 11.43,53.34 12.7,54.61 17.78,54.61 16.51,55.88
N$32
  Top 0.813: OK1.3 15.18,50.83 R10.1 15.09,48.41 16.51,46.99 16.51,44.34 R27.1
N$34
  Top 0.813: R31.1 23.38,6.87 23.25,6.74 22.86,6.74 | R55.2 22.86,6.74 | LED1.A 22.86,6.74
  Bottom 0.406: LED1.A 22.86,1.27 29.21,1.27 29.21,3.81 31.75,6.35 49.53,6.35 LED2.K
N$35  (2 unrouted)
  Top 0.813: R46.2 35.56,2.54 34.02,2.54 R45.1
  Top 4: R53.3 33.02,3.81 33.02,2.76 34.29,2.76
N$36
  Top 0.406: IC4.5 15.24,28.23 15.24,21.59 13.97,21.59 11.14,18.76 R41.1
N$37
  Top 0.61: IC2.6 27.79,13.34 | 27.79,13.34 R32.1 | R58.2 27.94,15.41 27.94,13.49 27.79,13.34
N$41
  Top 0.813: R27.2 11.6,44.28 Q1.G
  Top 1.27: D7.A 7.62,45.2 7.62,44.45 Q1.G
N$42  (1 unrouted)
  Top 0.813: R52.2 R39.1 15.66,5.5 15.24,5.08
  Top 2.54: R54.1 15.24,3.81
  Top 3: R54.1 16.14,3.81 16.22,3.89 16.22,4.22 14.77,4.22 14.72,4.27 14.63,4.18 14.63,3.85
N$45
  Top 0.813: R13.2 44.18,4.08 44.37,3.89 R53.1 44.37,3.73 42.76,2.12 R9.1
  Top 4: R53.1 44.45,3.73 | 44.45,3.73 44.45,2.76 45.72,2.76 | 44.45,3.73 45.64,3.73 45.72,3.81
N$46  (2 unrouted)
  Top 1.8: R50.1 43.94,36.32 44.13,36.51 44.13,36.83 38.1,36.83 38.1,33.02 43.18,33.02 43.18,35.56 39.37,35.56 | 39.37,34.29 41.91,34.29
N$47
  Bottom 0.406: U6.5 10.32,8.47 4.9,8.47 4.62,8.75 R63.1
  Bottom 0.61: U6.5 10.22,9.53 | R64.2 2.72,9.51 R63.1
N$48
  Top 0.406: IC2.1 37.13,10.79 | 37.13,10.79 42.55,10.79 42.85,10.49 C9.1 | IC2.5 33.26,14.61 33.96,13.91 33.96,10.86 34.29,10.86 | 34.29,10.86 34.23,10.79 | 34.29,10.86 37.07,10.86 37.13,10.79
  Top 0.813: C9.1 44.04,10.41 R34.1
N$49
  Bottom 0.406: R66.1 18.44,9.53 U6.4
N$50
  Bottom 0.61: U6.6 8.28,10.79 C33.2
  Bottom 0.813: C33.2 8.04,9.82 R61.1
N$51
  Bottom 0.61: U6.1 17.36,13.34 17.67,13.64 17.67,13.97
  Bottom 1.8: C36.1 17.65,16.5 17.67,16.51
  Bottom 2: 17.67,16.51 17.67,13.97
N$52  (1 unrouted)
  Top 1.8: 44.68,29.96 R7.1 44.63,27.05 42.11,27.05 42.11,29.79 43.18,29.79 | 44.68,29.96 44.69,29.97 | 44.68,29.96 44.51,29.79 43.18,29.79 | 43.18,29.79 43.4,29.58 43.4,28.04
N$53  (1 unrouted)
  Bottom 0.61: U6.8 10.03,13.34 8.63,14.73 D8.1
  Bottom 1.7: L3.1 7.62,15.88 C36.2
  Bottom 2.54: D8.1 7.19,15.67
N$54
  Bottom 0.813: C32.2 6.29,9.84 R61.2
  Bottom 1.016: 6.21,10.99 C32.2
N$55
  Bottom 0.813: R65.2 2.67,13.06 R64.1
N$56
  Bottom 0.813: R62.1 22.73,25 D10.K
N$57
  Bottom 0.406: R66.2 21.74,10.1 R67.2
N$61
  Top 0.813: R33.1 64.63,50.52 R38.1 61.82,49.53 OK4.3
N$62
  Top 0.813: OK4.1 51.67,51.73 R29.2
N$64
  Top 0.813: OK2.1 52.83,45.12 R28.1
N$65
  Top 0.406: C17.2 13.76,12.7 8.89,12.7 8.89,9.03 8.1,8.24 | 8.1,8.24 R26.2 | R22.2 8.1,8.24
  Top 0.813: U4.1 U4.2 13.64,14.04 C17.2
N$66
  Top 1.016: R8.1 73.99,14.03 R5.1
  Top 1.27: 74.04,12.06 R5.1
N$106  (1 unrouted)
  Top 0.406: R23.1 2.54,53.34 R42.2
  Top 2.54: Q3.E 11.96,61.11 10.07,60.98 9.46,60.94 9.28,58.34 11.34,58.34 11.16,59.78 | 8.89,59.69 10.16,59.69 5.08,54.61 R42.2
N$289
  Top 0.406: IC4.7 14.31,31.75 17.23,31.75 17.23,41.36 17.39,41.52 C14.2 21.2,41.52 24.13,44.45 24.13,52.07 26.25,54.19 R18.2
N$290  (1 unrouted)
  Top 0.813: R52.1 11.43,7.2 | 11.43,7.2 11.43,5.08 | C6.2 11.43,10.16 11.14,10.45 R41.2 11.43,10.99 11.43,7.2
  Top 3: R54.2 10.77,3.81 10.78,3.8 9.56,3.8 9.49,3.72 | 9.45,3.68 9.49,3.72 | 9.49,3.72 9.49,4.3 10.67,4.3
N$291
  Top 0.406: 6.11,11.94 R22.1 10.16,15.91 10.16,19.14 11.43,20.41 11.43,33.02 9.11,33.02 IC4.1
N$292
  Top 0.406: 8.12,30.45 IC4.3 5.11,30.45 4.66,30.9 R21.1 7.62,35.98 7.62,40.64 3.81,44.45 R17.2
N$294
  Top 0.406: 9.11,31.75 IC4.2 6.38,31.73 6.35,31.75 6.35,33.02 8.89,35.56 8.9,35.55 R19.1 | R19.1 11.25,34.95 | R20.1 11.01,35.79 R19.1
NONO
  cutout Bottom (no thermals): 2.15,17.77 11.66,17.77 11.8,17.91 11.94,18.05 11.94,27.97 2.36,27.97 2.08,28.24 2.08,18.03 2.15,17.97 2.34,17.78 2.54,17.78
NONO1
  cutout Top (no thermals): 64.77,34.29 64.77,20 64.78,19.99 78.37,19.99 78.7,19.66 78.7,33.99 78.36,34.33 64.81,34.33
OUT+  (via drill 1)  (3 unrouted)
  Top 0.813: D6.C 69.33,41.33 R3.2
  Top 1.27: D6.C 70.02,40.64 Q2.S
  Top 1.8: Q2.S 78.74,40.64 | v68.58,38.1 62.23,38.1 60.96,39.37 50.57,39.37 v48.84,37.64
  Bottom 0.813: D9.1 53.19,46.99 52.07,46.99 52.07,41.91 48.26,38.1 48.39,38.1 v48.84,37.64
  Bottom 1.27: X2.6 40.64,38.63 40.64,37.64 | R37.2 47.32,50.47 48.26,49.53 49.38,49.53 D4.C 50.16,49.25 50.99,49.25 51.98,48.26 54.61,48.26 | 54.61,48.26 54.71,48.36 D9.1 | C25.2 54.61,45.85 54.61,48.26 | C19.1 66.57,12.8 D5.C 69.14,12.7 72.39,12.7 72.43,12.66 R24.2 72.43,15.28 77.47,20.32 77.47,24.13 77.57,24.23 R44.2
  Bottom 1.8: 78.26,38.1 v68.58,38.1 | v48.84,37.64 40.64,37.64 | 40.64,38.63 31.43,38.63 23.08,46.99 Q1.D 10.16,46.99
  Bottom 2: 74.11,40.34 74.09,40.34 73.25,39.5 72.92,39.83 70.71,39.83 72.44,38.1
  Bottom 2.54: 72.92,39.83 73.38,39.37 78.74,39.37 79.55,38.56 79.55,25.08
OUTONOFFPB0
  Top 0.813: X2.9 45.72,45.72 45.95,45.95 | R29.1 48.48,48.48 47.22,47.22 45.95,45.95 | R28.2 45.95,45.95
PA1IL
  Top 0.254: R12.2 28.52,40.17 32.8,44.45 X2.1
PA2IO
  Top 0.254: X2.5 39.37,43.18 39.37,39.37 36.71,38.46 36.62,38.46 R16.1
V+  (via drill 0.35, 0.5)  (1 unrouted)
  Top 0.406: v58.42,49.53 58.48,49.47 58.48,48.26
  Top 0.813: OK1.4 19,48.28 19.02,48.26 21.59,48.26 v21.59,54.61 | OK2.4 59.02,45.12 58.48,45.66 58.48,48.26 58.48,52.07 58.48,52.44 60.76,52.44 OK4.4
  Top 1.27: 58.45,52.11 58.48,52.07
  Bottom 0.406: 52.07,54.61 52.07,50.8 55.88,50.8 57.15,49.53 v58.42,49.53 61.47,49.53 D11.2
  Bottom 0.813: v21.59,54.61 52.07,54.61 52.09,54.63
  Bottom 1.27: R37.1 47,53.86 D4.A | C20.1 62.25,48.75 D11.2

### Text on the board
Top: PS+Load Rev3.0 / Vasyld 21.01.2019
tPlace: +12v | GND | ~5-10V | LM258 | GND | OUT+ | In- | TPS54340 | In+ | lm7805 | LM258 | OUT-
bPlace: ~12v | 12v | Base | Gate | Gate | Gate | PS + Load | A | + | REV3.0 | GND | + | Vasyld / 21.01.2019 | OUT - | OUT+ | IN- | max 38v | IN+ | + | A | A | OUT-